# EAGLE schematic Versorgungseinheit_v2 (EAGLE 6.5.0)
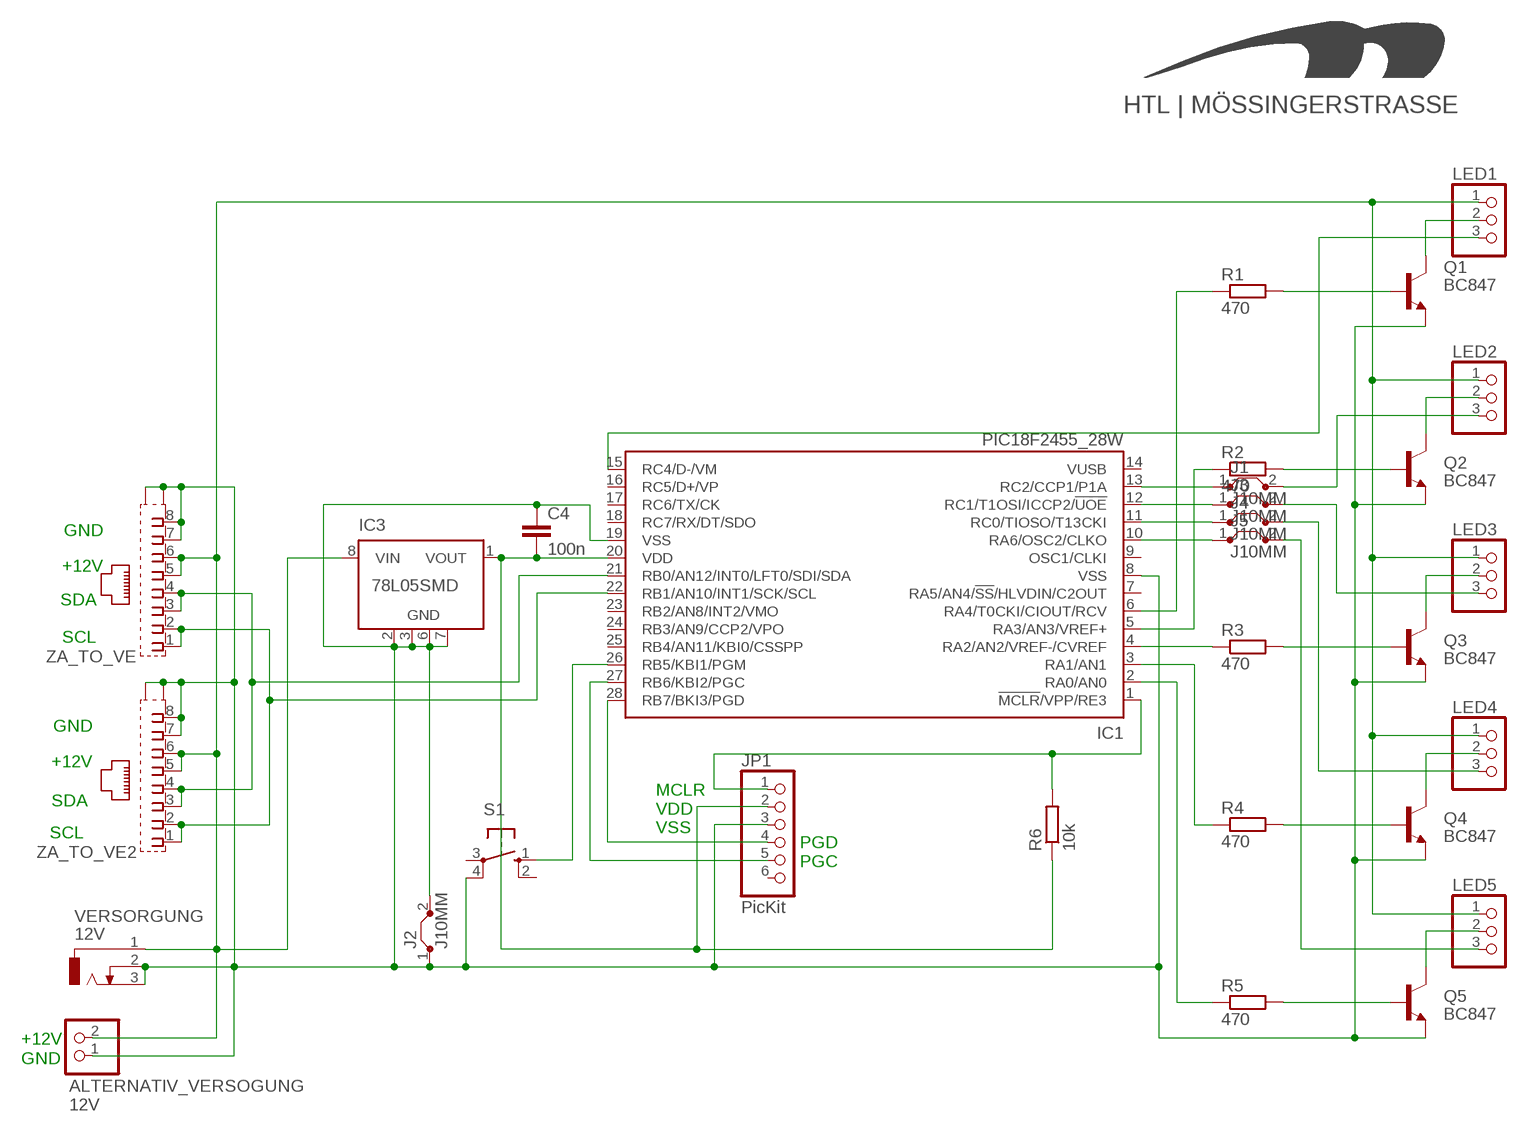
[diagram p0: schematic, sheet 1]

## Parts
ALTERNATIV_VERSOGUNG  12V  PINHD-1X2  [1X02]
C4  100n  C-EUC1206  [C1206]
IC1  PIC18F2455_28W  [SO28W]
IC3  78L05SMD  [SO08]
J1  J10MM  [10]
J2  J10MM  [10]
J3  J10MM  [10]
J4  J10MM  [10]
J5  J10MM  [10]
JP1  PicKit  PINHD-1X6  [1X06]
LED1  PINHD-1X3  [1X03]
LED2  PINHD-1X3  [1X03]
LED3  PINHD-1X3  [1X03]
LED4  PINHD-1X3  [1X03]
LED5  PINHD-1X3  [1X03]
Q1  BC847  [SOT23]
Q2  BC847  [SOT23]
Q3  BC847  [SOT23]
Q4  BC847  [SOT23]
Q5  BC847  [SOT23]
R1  470  R-EU_R1206  [R1206]
R2  470  R-EU_R1206  [R1206]
R3  470  R-EU_R1206  [R1206]
R4  470  R-EU_R1206  [R1206]
R5  470  R-EU_R1206  [R1206]
R6  10k  R-EU_R1206  [R1206]
S1  10-XX  [B3F-10XX]
U$1  HTL_LOGOBOTTOP_15MM  [LOGO_15]
VERSORGUNG  12V  DCJ0303  [DCJ0303]
ZA_TO_VE  555141-1  [555153-1]
ZA_TO_VE2  555141-1  [555153-1]

## Nets
N$1: IC1.2(RA0/AN0) R5.1
N$2: IC1.3(RA1/AN1) R4.1
N$3: IC1.6(RA4/T0CKI/CIOUT/RCV) R1.1
N$4: IC1.4(RA2/AN2/VREF-/CVREF) R3.1
N$5: IC1.26(RB5/KBI1/PGM) S1.1(S)
N$7: IC1.5(RA3/AN3/VREF+) R2.1
N$8: J5.2 LED5.3
N$9: Q1.1(B) R1.2
N$10: Q2.1(B) R2.2
N$11: Q3.1(B) R3.2
N$12: Q4.1(B) R4.2
N$13: Q5.1(B) R5.2
N$14: LED1.2 Q1.3(C)
N$15: LED2.2 Q2.3(C)
N$16: LED3.2 Q3.3(C)
N$17: LED4.2 Q4.3(C)
N$18: LED5.2 Q5.3(C)
N$19: J4.2 LED4.3
N$20: C4.2 IC1.20(VDD) IC3.1(VOUT) JP1.2 R6.1
N$21: J3.2 LED3.3
N$22: IC1.13(RC2/CCP1/P1A) J1.1
N$23: IC1.15(RC4/D-/VM) LED1.3
N$27: IC1.28(RB7/BKI3/PGD) JP1.4
N$29: IC1.27(RB6/KBI2/PGC) JP1.5
N$30: IC1.1(!MCLR!/VPP/RE3) JP1.1 R6.2
N$31: J1.2 LED2.3
N$32: IC1.12(RC1/T1OSI/ICCP2/!UOE) J3.1
N$33: IC1.11(RC0/TIOSO/T13CKI) J4.1
N$34: IC1.10(RA6/OSC2/CLKO) J5.1
SCL: IC1.22(RB1/AN10/INT1/SCK/SCL) ZA_TO_VE2.1 ZA_TO_VE2.2 ZA_TO_VE.1 ZA_TO_VE.2
SDA: IC1.21(RB0/AN12/INT0/LFT0/SDI/SDA) ZA_TO_VE2.3 ZA_TO_VE2.4 ZA_TO_VE.3 ZA_TO_VE.4
VDD: ALTERNATIV_VERSOGUNG.2 IC3.8(VIN) LED1.1 LED2.1 LED3.1 LED4.1 LED5.1 VERSORGUNG.1 ZA_TO_VE2.5 ZA_TO_VE2.6 ZA_TO_VE.5 ZA_TO_VE.6
VSS: ALTERNATIV_VERSOGUNG.1 C4.1 IC1.8(VSS) IC1.19(VSS) IC3.2(GND) IC3.3(GND) IC3.6(GND) IC3.7(GND) J2.1 J2.2 JP1.3 Q1.2(E) Q2.2(E) Q3.2(E) Q4.2(E) Q5.2(E) S1.4(P1) VERSORGUNG.2 VERSORGUNG.3 ZA_TO_VE2.7 ZA_TO_VE2.8 ZA_TO_VE2.G1(S1) ZA_TO_VE2.G2(S2) ZA_TO_VE.7 ZA_TO_VE.8 ZA_TO_VE.G1(S1) ZA_TO_VE.G2(S2)
Unconnected: IC1.7(RA5/AN4/!SS!/HLVDIN/C2OUT) IC1.9(OSC1/CLKI) IC1.14(VUSB) IC1.16(RC5/D+/VP) IC1.17(RC6/TX/CK) IC1.18(RC7/RX/DT/SDO) IC1.23(RB2/AN8/INT2/VMO) IC1.24(RB3/AN9/CCP2/VPO) IC1.25(RB4/AN11/KBI0/CSSPP) IC3.4(NC) IC3.5(NC) JP1.6 S1.2(S1) S1.3(P)

## Notes on the sheet
- GND
- +12V
- SDA
- SCL
- GND
- +12V
- SDA
- MCLR
  VDD
  VSS
- SCL
- PGD
  PGC
- +12V
- GND

## Library data of the parts
ALTERNATIV_VERSOGUNG = pinhead:PINHD-1X2: PIN HEADER
C4 = resistor:C-EU: CAPACITOR, European symbol
IC1 = microchip:PIC18F2*_28: USB Microcontrollers with nanoWatt Technology High-Performance, Enhanced Flash, 28/40/44-Pin, Source: http://ww1.microchip.com/downloads/en/devicedoc/39632c.pdf; MF: MICROCHIP; MPN: PIC18F2455-I/SO; OC_FARNELL: 1579598; OC_NEWARK: 64J3768
IC3 = linear:78L*SMD: Positive VOLTAGE REGULATOR
J1-J5 = jumper:J: Bridge
JP1 = pinhead:PINHD-1X6: PIN HEADER
LED1-LED5 = pinhead:PINHD-1X3: PIN HEADER
Q1-Q5 = transistor:BC847: NPN TRANSISTOR
R1-R6 = resistor:R-EU_: RESISTOR, European symbol
S1 = switch-omron:10-XX: OMRON SWITCH; MPN: B3F-1000; OC_FARNELL: 176432; OC_NEWARK: 36M3542
U$1 = HTL-Logo:HTL_LOGO
VERSORGUNG = con-jack:DCJ0303: DC POWER JACK Source: DCJ0303.pdf; OC_FARNELL: unknown; OC_NEWARK: unknown
ZA_TO_VE ZA_TO_VE2 = con-amp:555141-1: AMP connector